# EAGLE design FEP_Exodia (EAGLE 9.6.2)
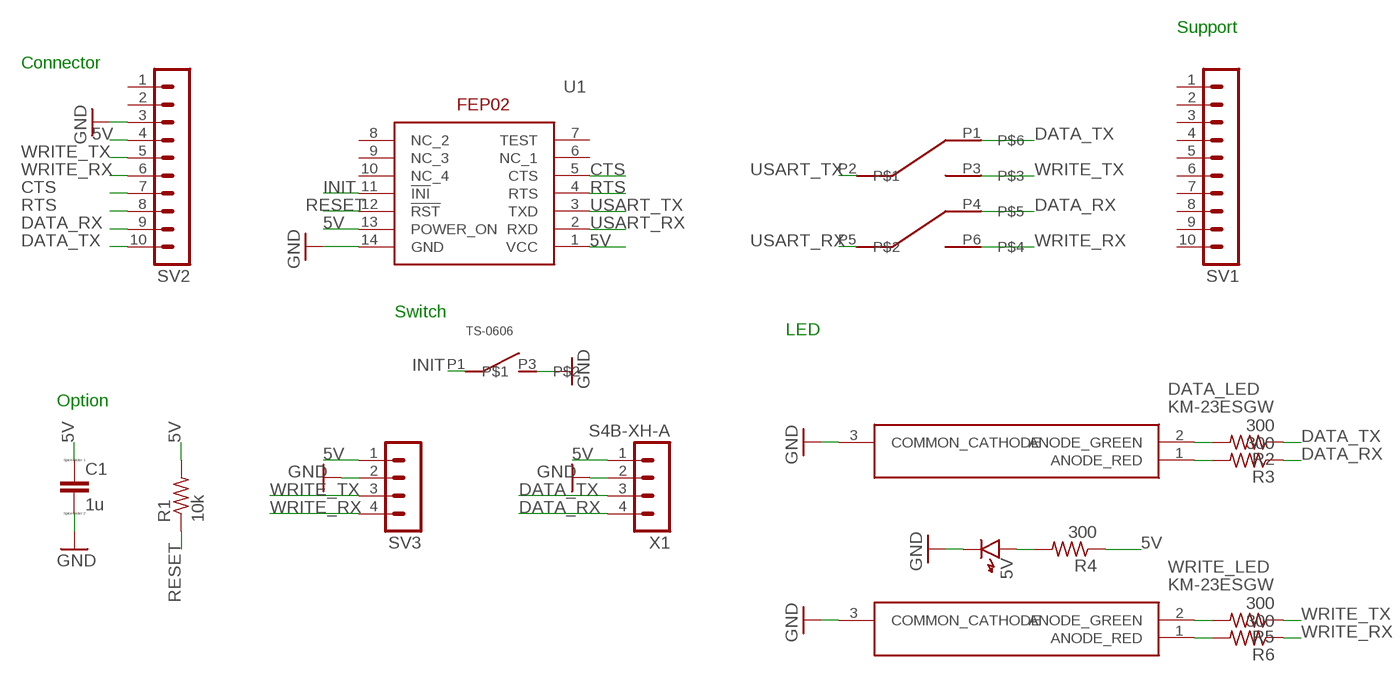
[diagram p0: schematic, sheet 1]

## Parts
5V  LED1608  [LED1608]
C1  1u  CC0603  [C0603]
DATA_LED  KM-23ESGW  [SOT-23]
R1  10k  R-US_R0603  [R0603]
R2  300  R-US_R0603  [R0603]
R3  300  R-US_R0603  [R0603]
R4  300  R-US_R0603  [R0603]
R5  300  R-US_R0603  [R0603]
R6  300  R-US_R0603  [R0603]
SV1  MA10-1  [MA10-1]
SV2  MA10-1  [MA10-1]
SV3  MA04-1  [MA04-1]
SW_1  P-03647_TS-0606  [TS-0606]
SW_3  P-08784_PS-70S  [PS-70S]
U1  FEP02  [FEP02]
WRITE_LED  KM-23ESGW  [SOT-23]
X1  S4B-XH-A  [S4B-XH-A]

## Nets
5V: C1.1 R1.2 R4.1 SV2.4 SV3.1 U1.1(VCC) U1.13(POWER_ON) X1.1
CTS: SV2.7 U1.5(CTS)
DATA_RX: R3.1 SV2.9 SW_3.P4 X1.4
DATA_TX: R2.1 SV2.10 SW_3.P1 X1.3
GND: 5V.K C1.2 DATA_LED.3(COMMON_CATHODE) SV2.3 SV3.2 SW_1.P3 U1.14(GND) WRITE_LED.3(COMMON_CATHODE) X1.2
INIT: SW_1.P1 U1.11(!INI)
N$1: DATA_LED.1(ANODE_RED) R3.2
N$2: DATA_LED.2(ANODE_GREEN) R2.2
N$3: 5V.A R4.2
N$4: R6.2 WRITE_LED.1(ANODE_RED)
N$5: R5.2 WRITE_LED.2(ANODE_GREEN)
RESET: R1.1 U1.12(!RST)
RTS: SV2.8 U1.4(RTS)
USART_RX: SW_3.P5 U1.2(RXD)
USART_TX: SW_3.P2 U1.3(TXD)
WRITE_RX: R6.1 SV2.6 SV3.4 SW_3.P6
WRITE_TX: R5.1 SV2.5 SV3.3 SW_3.P3
Unconnected: SV1.1 SV1.2 SV1.3 SV1.4 SV1.5 SV1.6 SV1.7 SV1.8 SV1.9 SV1.10 SV2.1 SV2.2 U1.6(NC_1) U1.7(TEST) U1.8(NC_2) U1.9(NC_3) U1.10(NC_4)

## Notes on the sheet
- Support
- Connector
- Switch
- LED
- Option

## Library data of the parts
5V = generic:LED: Generic LEDs
C1 = eagle-ltspice:C: CAPACITOR, European symbol; SPICEMODEL: NONE; SPICEPREFIX: C
DATA_LED WRITE_LED = SamacSys_Parts:KM-23ESGW: KINGBRIGHT - KM-23ESGW - LED, SMD, RED/GRN Source: Datasheet <http://www.farnell.com/datasheets/2047454.pdf>; DESCRIPTION: KINGBRIGHT - KM-23ESGW - LED, SMD, RED/GRN; HEIGHT: mm; MANUFACTURER_NAME: Kingbright; MANUFACTURER_PART_NUMBER: KM-23ESGW; MOUSER_PART_NUMBER: N/A; MOUSER_PRICE-STOCK: https://www.mouser.com/Search/Refine.aspx?Keyword=N%2FA
R1-R6 = audio amplifier example:R-US_: RESISTOR, American symbol
SV1 SV2 = con-lstb:MA10-1: PIN HEADER; OC_FARNELL: unknown; OC_NEWARK: unknown
SV3 = con-lstb:MA04-1: PIN HEADER; OC_FARNELL: unknown; OC_NEWARK: unknown
SW_1 = Akizuki:P-03647_TS-0606
SW_3 = Akizuki:P-08784_PS-70S
U1 = SamacSys_Parts:FEP02: 920MHz band wireless module [1mW type] FEP-02 Source: Datasheet <https://d21xsz2za2b5mz.cloudfront.net/9616/1948/4745/1M36Q03507_FEP01_02TJ010V7.pdf>; DESCRIPTION: 920MHz band wireless module [1mW type] FEP-02; HEIGHT: 3mm; MANUFACTURER_NAME: Futaba; MANUFACTURER_PART_NUMBER: FEP02
X1 = con-JST_XH:S4B-XH: JST XH series header 2.50mm pitch disconnectable crimp style connectors, horizontal (side entry type), 4 pins

## Board
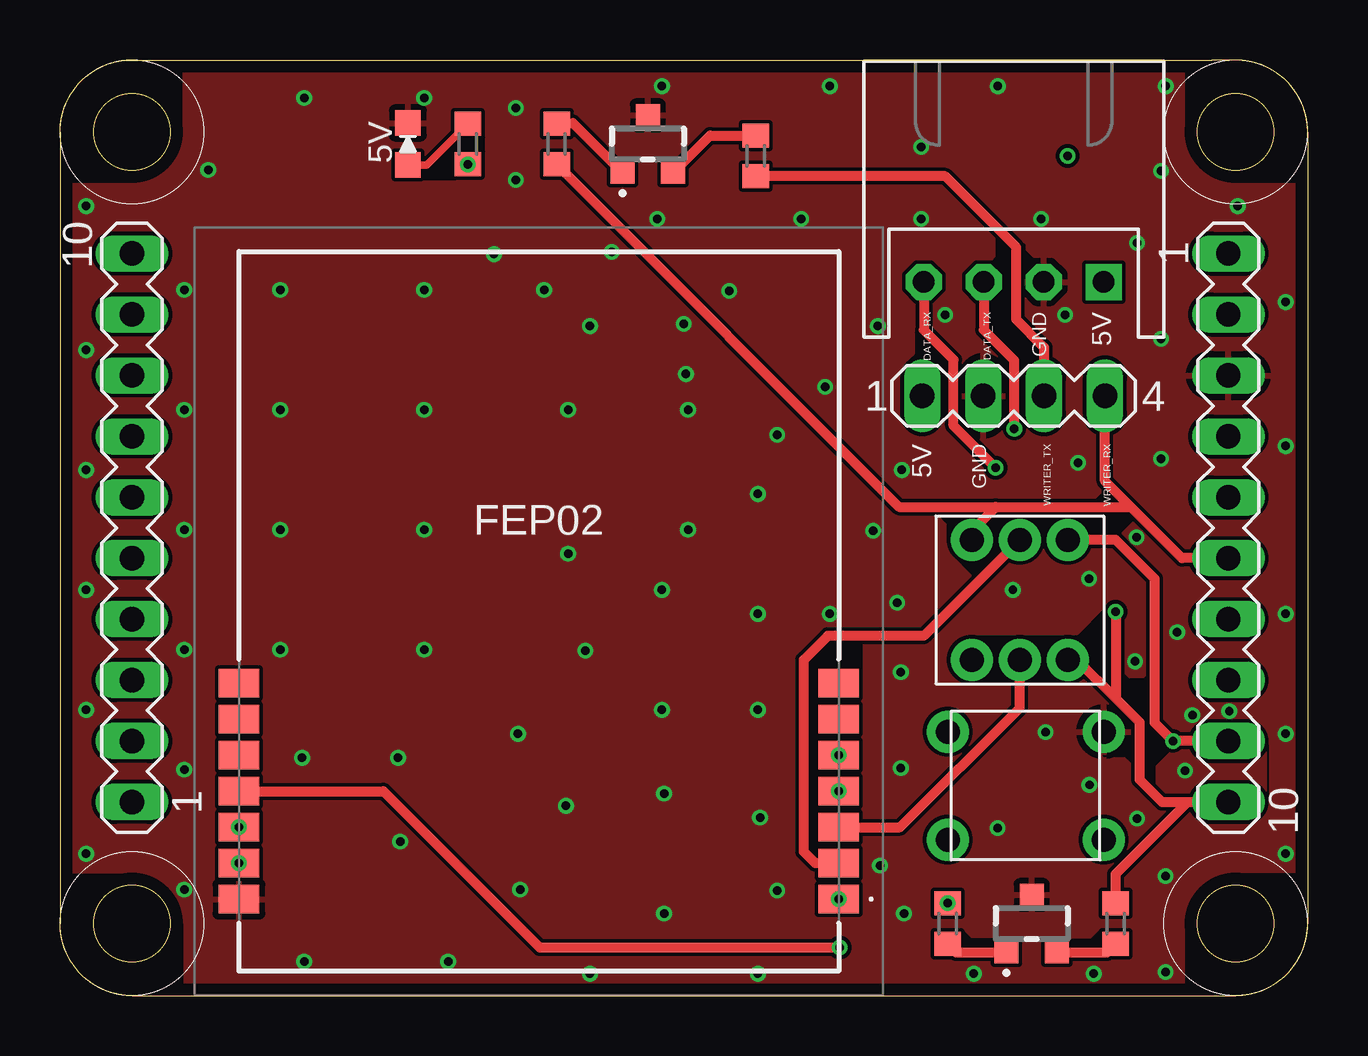
[diagram p1: board, top side]
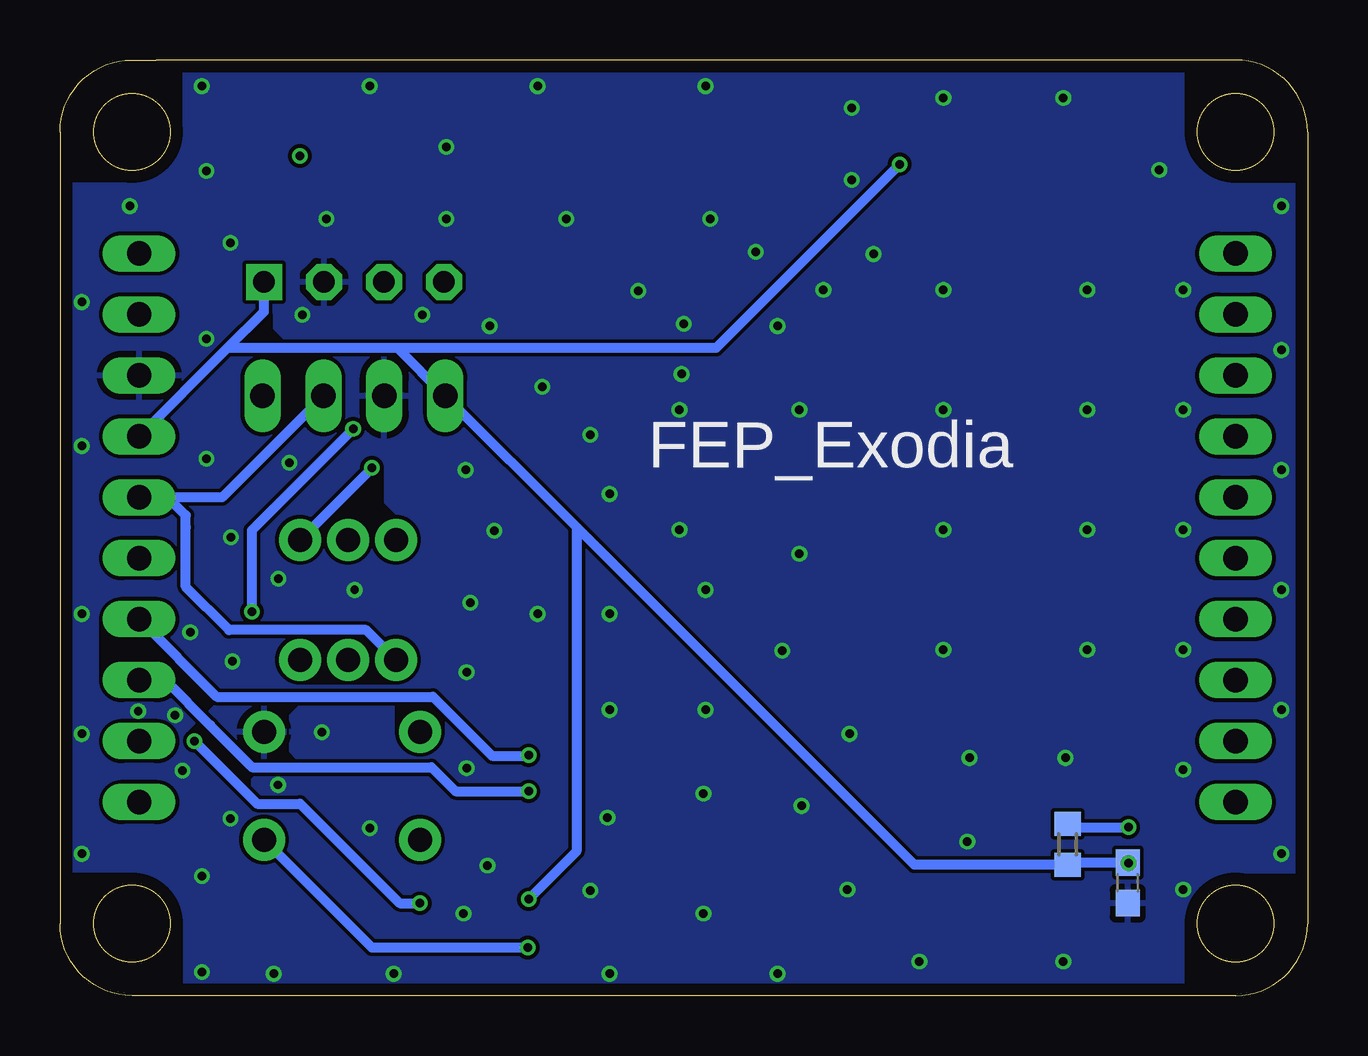
[diagram p2: board, bottom side, seen from below]

Size 52 x 39 mm. Coordinates in mm from the lower left corner, seen from the top.
Outline: 3,0 48,0 49,0 arc90 52,3 52,36 arc90 49,39 48,39 3,39 arc90 0,36 0,3 arc90 3,0
Outline: circle at 3,3 radius 1.6
Outline: circle at 3,36 radius 1.6
Outline: circle at 49,3 radius 1.6
Outline: circle at 49,36 radius 1.6
Copper layers (1*16): Top 0.035mm / dielectric 1.6mm / Bottom 0.035mm
Design rules "Elecrow_2-layer_PCB_eagle_rule": minimum track width 6mil, minimum drill 12mil, track to track 6mil, track to pad 6mil, pad to pad 6mil, via to via 8mil, smd to smd 0mil, copper to edge 20mil, drill to drill 10mil, minimum pad ring 6mil, minimum via ring 6mil, stop-mask expansion 0mil, vias tented up to drill 100mil, thermal gap 10mil
tRestrict: 42 lines
bRestrict: 24 lines

### Footprints (pad centres in the part's own frame; a part is rotated, then mirrored left to right if it is on the bottom)
LED1608 = smd 1.05 x 1.08: A -0.875,0; K 0.875,0
C0603 = smd 1.1 x 1: 1 -0.85,0; 2 0.85,0
SOT-23 = smd 1 x 0.9: 1 1.05,1.2; 2 -1.05,1.2; 3 0,-1.2
R0603 = smd 1 x 1.1: 1 -0.85,0; 2 0.85,0
MA10-1 = drill 1.016 long: 1 -11.43,0; 2 -8.89,0; 3 -6.35,0; 4 -3.81,0; 5 -1.27,0; 6 1.27,0; 7 3.81,0; 8 6.35,0; 9 8.89,0; 10 11.43,0
MA04-1 = drill 1.016 long: 1 -3.81,0; 2 -1.27,0; 3 1.27,0; 4 3.81,0
TS-0606 = drill 1 pad 1.75: P1 0,4.5; P2 6.5,4.5; P3 0,0; P4 6.5,0
PS-70S = drill 1 pad 1.75: P1 0,5; P2 2,5; P3 4,5; P4 0,0; P5 2,0; P6 4,0
FEP02 = smd 1.7 x 1.2: 1 12.5,-12; 2 12.5,-10.5; 3 12.5,-9; 4 12.5,-7.5; 5 12.5,-6; 6 12.5,-4.5; 7 12.5,-3; 8 -12.5,-3; 9 -12.5,-4.5; 10 -12.5,-6; 11 -12.5,-7.5; 12 -12.5,-9; 13 -12.5,-10.5; 14 -12.5,-12
S4B-XH-A = drill 0.9 pad 1.5 square: 1 3.75,0 | drill 0.9 pad 1.5 octagon: 2 1.25,0; 3 -1.25,0; 4 -3.75,0

### Placement (x,y rotation side)
5V  14.5,35.5 90 top
C1  7.5,4.7 270 bottom
DATA_LED  40.5,3 180 top
R1  10,6.3 270 bottom
R2  44,3 270 top
R3  37,3 270 top
R4  17,35.5 90 top
R5  29,35 90 top
R6  20.7,35.5 90 top
SV1  3,19.5 90 top
SV2  48.7,19.5 270 top
SV3  39.75,25 0 top
SW_1  43.5,11 180 top
SW_3  42,19 180 top
U1  19.96,16.02 0 top
WRITE_LED  24.5,35.5 180 top
X1  39.75,29.75 0 top

### Tracks (layer width: path | path; a pad name or v marks a point on that pad's centre or on a via)
5V  (via drill 0.35)
  Bottom 0.406: 30.47,19.53 16.39,5.45 R1.2 9.9,5.55 C1.1 U1.13 | 30.47,19.53 SV3.1 37.95,27 | 30.47,19.53 30.47,6.01 U1.1 | SV2.4 45.01,27 | 45.01,27 43.5,28.51 X1.1 | 45.01,27 37.95,27 | 37.95,27 24.64,27 R4.1
  other vias: 17,34.65 32.46,4.02 7.46,5.52
CTS  (via drill 0.35)
  Bottom 0.406: SV2.7 45.46,12.45 36.45,12.45 34,10 32.48,10 U1.5
  other vias: 32.46,10.02
DATA_RX  (via drill 0.35)
  Top 0.406: X1.4 36,27.75 37.24,26.51 37.24,23.76 v39,22 | SV2.9 v46.39,10.61 45.63,11.37 45.63,17.37 44,19 SW_3.P4
  Bottom 0.406: v46.39,10.61 v46.39,10.6 43.79,8 41.99,8 37.84,3.85 R3.1 | v39,22 SW_3.P4
  other vias: 37,3.85
DATA_TX  (via drill 0.35)
  Top 0.406: X1.3 38.5,27.75 39.78,26.47 v39.78,23.63 | 47,8.07 45.93,8.07 45,9 45,11.39 44,12.39 | R2.1 44,5.07 47,8.07 | 47,8.07 SV2.10 | SW_3.P1 42.39,14 44,12.39 | v44,16 44,12.39
  Bottom 0.406: v44,16 44,19.4 v39.78,23.62 v39.78,23.63
GND  (via drill 0.35)
  other vias: 26,28 23,31 19,34 19,37 15.18,37.42 10.18,37.42 6.18,34.42 5.18,29.42 5.18,24.42 5.18,19.42 5.18,14.42 5.18,9.42 5.18,4.42 10.18,1.42 16.18,1.42 14.18,6.42 19.18,4.42 25.18,3.42 35.18,3.42 29.18,7.42 34.18,5.42 35.05,9.48 35.05,13.48 41.08,10.98 39.08,6.98 46.08,4.98 46.08,0.98 43.09,0.91 38.09,0.91 29.09,0.91 22.09,0.91 51.09,5.91 51.09,10.91 51.09,15.91 51.09,22.91 51.09,28.91 49.09,32.91 46.09,37.91 39.09,37.91 32.09,37.91 25.09,37.91 10.09,9.91 14.09,9.91 34.9,16.37 33.9,19.37 29.9,23.37 31.9,25.37 27.9,29.37 24.9,32.37 30.9,32.37 35.9,32.37 35.9,35.37 40.9,32.37 41.9,28.37 45.9,22.37 39.72,16.91 46.57,15.14 29.09,15.91 25.09,11.91 19.09,10.91 25.09,16.91 29.09,20.91 35.09,21.91 34.09,27.91 22.09,27.91 18.09,30.91 26.09,25.91 1.09,32.91 1.09,26.91 1.09,11.91 1.09,16.91 1.09,21.91 1.09,5.91 21.09,7.91 29.09,11.91 32.09,15.91 45.9,34.37 45.9,27.37 44.9,31.37 42.9,17.37 46.9,9.37 44.9,7.37 29.9,4.37 21.9,14.37 36.9,28.37 42.91,8.78 47.2,11.69 48.74,11.86 44.88,19.1 42.44,22.21 44.81,13.93 9.18,29.42 15.18,29.42 20.18,29.42 26.18,24.42 21.18,24.42 15.18,24.42 9.18,24.42 9.18,19.42 15.18,19.42 21.18,18.42 26.18,19.42 15.18,14.42 9.18,14.42 25.18,8.42
  pour Top: -3,43 57,43 57,-4 -3,-4
  pour Bottom: -6,45 59,45 59,22 59,-6 -6,-6
INIT  (via drill 0.35)
  Top 0.406: U1.11 13.48,8.52 20,2 v32.5,2
  Bottom 0.406: SW_1.P1 39,2 v32.5,2
N$1
  Top 0.406: R3.2 37.35,1.8 DATA_LED.1
N$2
  Top 0.406: DATA_LED.2 43.65,1.8 R2.2
N$3
  Top 0.305: 5V.A 15.28,34.62 R4.2
N$4
  Top 0.406: R6.2 21.38,36.37 WRITE_LED.1
N$5
  Top 0.406: WRITE_LED.2 27.1,35.85 R5.2
N$19  (via drill 0.35)
  other vias: 42,35
RESET  (via drill 0.35)
  Bottom 0.406: R1.1 9.87,7.02 U1.12
  other vias: 7.46,7.02
RTS  (via drill 0.35)
  Bottom 0.406: SV2.8 47.62,13.15 45.73,11.27 43.99,9.52 36.52,9.52 35.52,8.52 U1.4
  other vias: 32.46,8.52
USART_RX
  Top 0.406: SW_3.P5 36,15 32,15 31,14 31,6 31.48,5.52 U1.2
USART_TX
  Top 0.406: U1.3 35.02,7.02 40,12 SW_3.P2
WRITE_RX
  Top 0.406: SV2.6 46.77,18.23 44.63,20.37 | 39,20.37 44.63,20.37 | R6.1 34.97,20.37 39,20.37 | 39,20.37 38,19.37 SW_3.P6 | 44.63,20.37 43.56,21.44 SV3.4
WRITE_TX
  Top 0.406: R5.1 36.9,34.15 39.86,31.19 39.86,28.18 41.02,27.02 SV3.3
  Bottom 0.406: SV2.5 48,20.77 47.51,20.77 | SV3.3 45.25,20.77 47.51,20.77 | SW_3.P3 39.23,15.23 44.95,15.23 46.76,17.04 46.76,19.52 46.76,20.02 47.51,20.77

### Text on the board
tNames: DATA_RX | DATA_TX | GND | 5V | 5V | GND | WRITER_TX | WRITER_RX
bNames: FEP_Exodia